# Altium schematic sheet Digital_IP.SchDoc
size A; DocumentNumber: 15; SheetNumber: 15; SheetTotal: 18
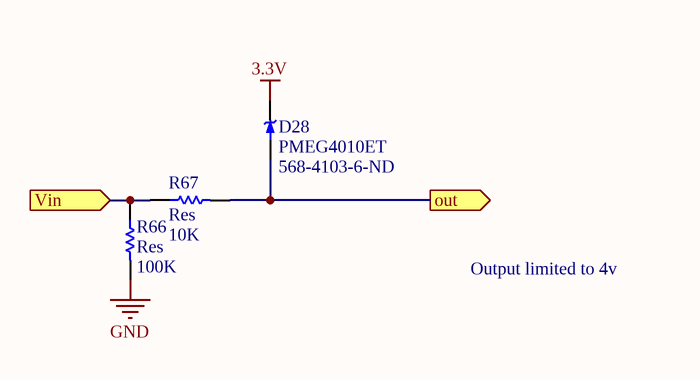
[diagram p0: Digital_IP.SchDoc]

## Parts
D28  PMEG4010ET  Supplier Part Number 1: 568-4103-6-ND  [SOT23-3]
R66  Res  value 100K  [2012[0805]]
R67  Res  value 10K  [2012[0805]]

## Ports
out (out), Vin (in)

## Nets
3.3V: D28.3
GND: R66.2
out: D28.1 R67.2 ; port out
Vin: R66.1 R67.1 ; port Vin

## Notes on the sheet
- Output limited to 4v

## Library data of the parts
D28 = PMEG4010ET: SCHOTTKY RECT 40V 1A SOT-23; Supplier 1: Digi-Key
R66 R67 = Res: Surface Mount Resistor; Published: 8-Jun-2000; LatestRevisionDate: 17-Jul-2002; LatestRevisionNote: Re-released for DXP Platform.; PackageReference: AXIAL-0.5; Publisher: Altium Limited